# EAGLE design brick_3pin_led_ring (EAGLE 7.4.0)
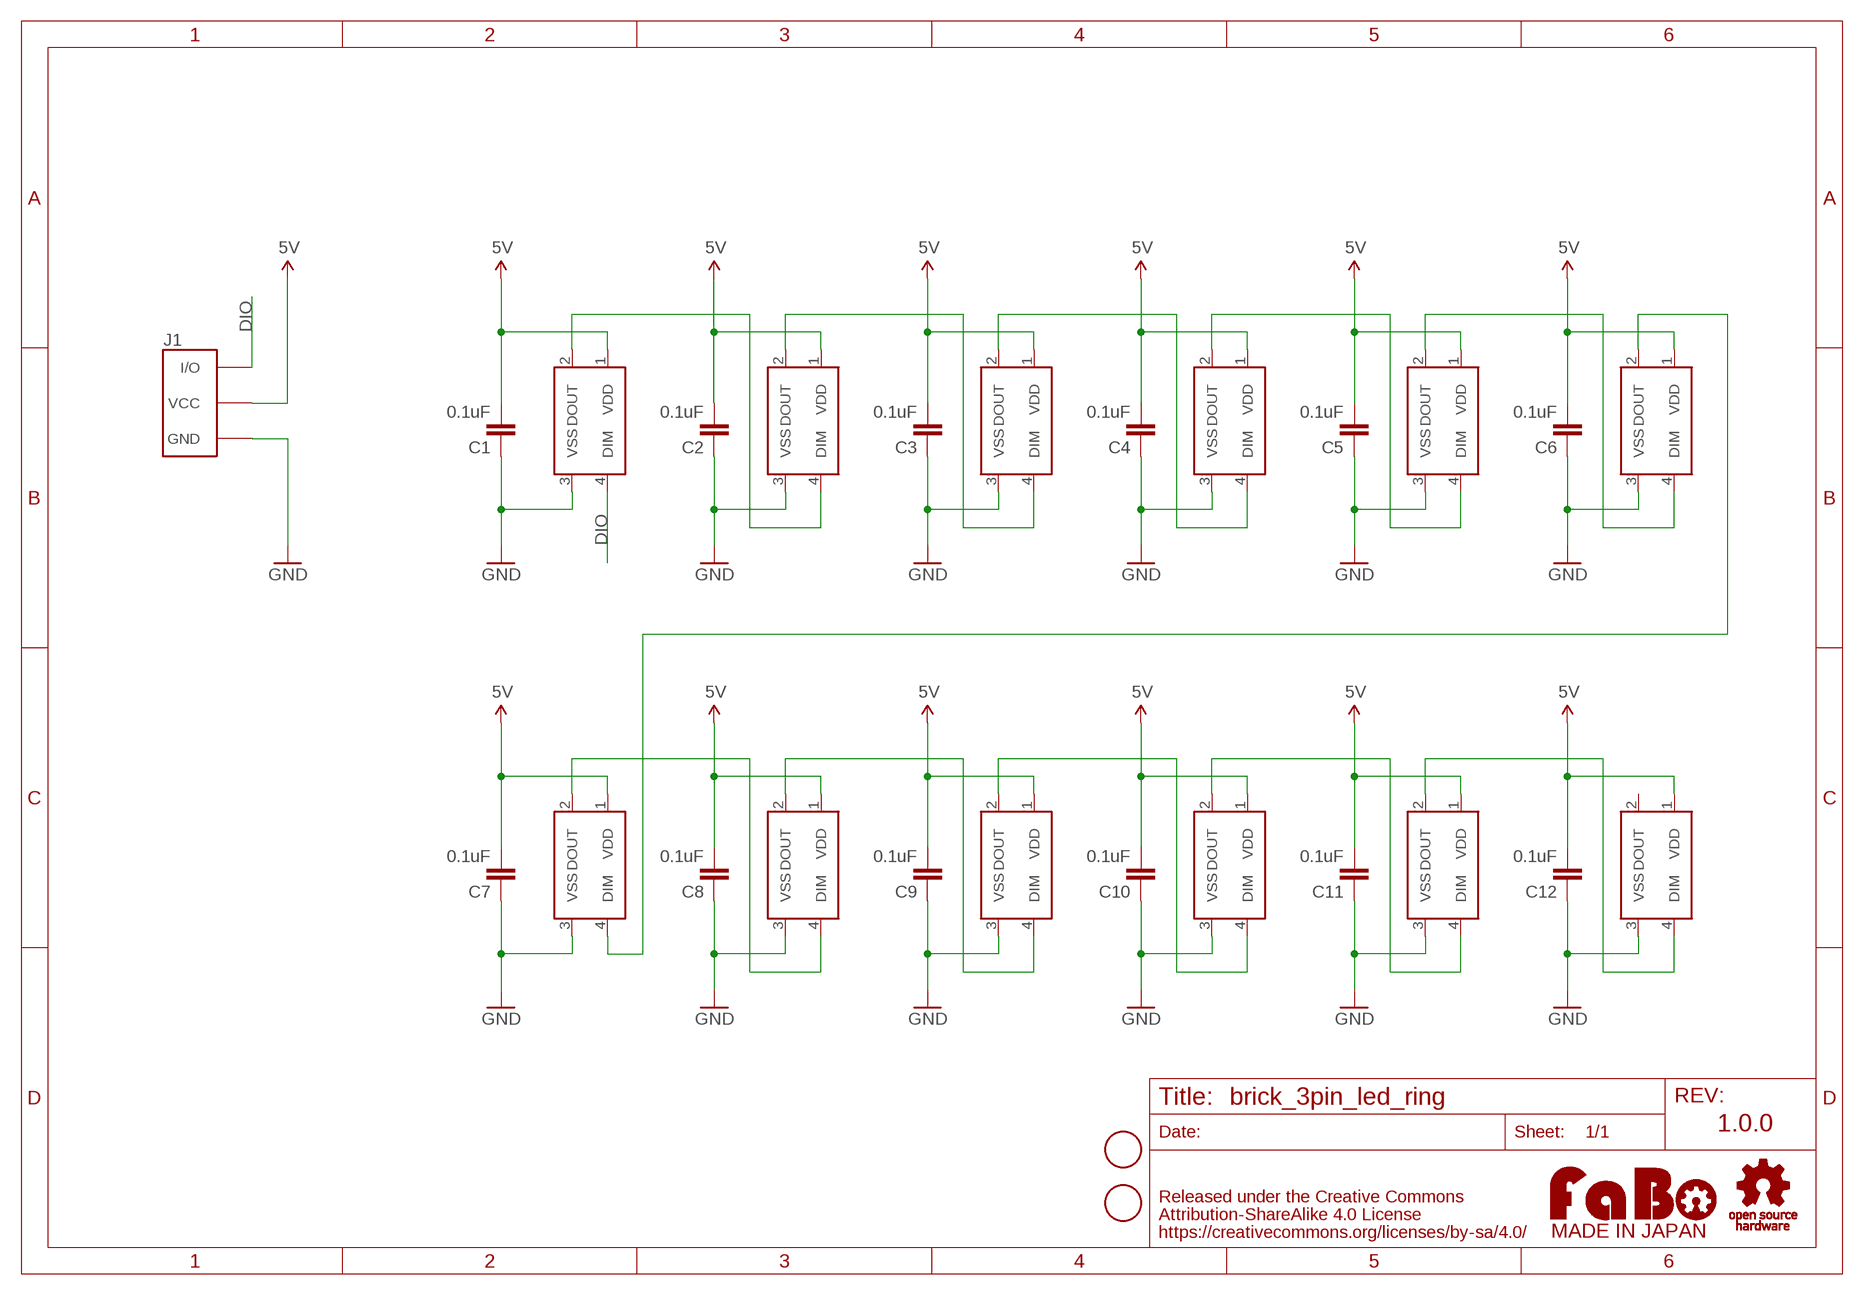
[diagram p0: schematic, sheet 1]

## Parts
C1  0.1uF  CAP-EIA0603  [EIA0603]
C2  0.1uF  CAP-EIA0603  [EIA0603]
C3  0.1uF  CAP-EIA0603  [EIA0603]
C4  0.1uF  CAP-EIA0603  [EIA0603]
C5  0.1uF  CAP-EIA0603  [EIA0603]
C6  0.1uF  CAP-EIA0603  [EIA0603]
C7  0.1uF  CAP-EIA0603  [EIA0603]
C8  0.1uF  CAP-EIA0603  [EIA0603]
C9  0.1uF  CAP-EIA0603  [EIA0603]
C10  0.1uF  CAP-EIA0603  [EIA0603]
C11  0.1uF  CAP-EIA0603  [EIA0603]
C12  0.1uF  CAP-EIA0603  [EIA0603]
J1  BRICK_3PIN_CONNECTOR  [BRICK_3PIN_CONNECTOR]
U$2  WS2818B  [WS2818B]
U$3  WS2818B  [WS2818B]
U$4  WS2818B  [WS2818B]
U$5  WS2818B  [WS2818B]
U$6  WS2818B  [WS2818B]
U$7  WS2818B  [WS2818B]
U$8  WS2818B  [WS2818B]
U$9  WS2818B  [WS2818B]
U$10  WS2818B  [WS2818B]
U$11  WS2818B  [WS2818B]
U$12  WS2818B  [WS2818B]
U$13  WS2818B  [WS2818B]
U$14  LOGO_FABO-M  [LOGO_FABO_M]
U$15  LOGO_OSHW_T-M  [LOGO_OSHW_T_M]
U$16  SCREW-PAD-3MM  [SCREWPAD_3MM]
U$17  SCREW-PAD-3MM  [SCREWPAD_3MM]

## Nets
5V: C1.2 C2.2 C3.2 C4.2 C5.2 C6.2 C7.2 C8.2 C9.2 C10.2 C11.2 C12.2 J1.VCC U$2.1(VDD) U$3.1(VDD) U$4.1(VDD) U$5.1(VDD) U$6.1(VDD) U$7.1(VDD) U$8.1(VDD) U$9.1(VDD) U$10.1(VDD) U$11.1(VDD) U$12.1(VDD) U$13.1(VDD)
DIO: J1.IN/OUT(I/O) U$2.4(DIM)
GND: C1.1 C2.1 C3.1 C4.1 C5.1 C6.1 C7.1 C8.1 C9.1 C10.1 C11.1 C12.1 J1.GND U$2.3(VSS) U$3.3(VSS) U$4.3(VSS) U$5.3(VSS) U$6.3(VSS) U$7.3(VSS) U$8.3(VSS) U$9.3(VSS) U$10.3(VSS) U$11.3(VSS) U$12.3(VSS) U$13.3(VSS)
N$1: U$2.2(DOUT) U$3.4(DIM)
N$3: U$3.2(DOUT) U$4.4(DIM)
N$11: U$4.2(DOUT) U$5.4(DIM)
N$12: U$5.2(DOUT) U$6.4(DIM)
N$13: U$6.2(DOUT) U$7.4(DIM)
N$14: U$7.2(DOUT) U$8.4(DIM)
N$15: U$8.2(DOUT) U$9.4(DIM)
N$16: U$9.2(DOUT) U$10.4(DIM)
N$17: U$10.2(DOUT) U$11.4(DIM)
N$18: U$11.2(DOUT) U$12.4(DIM)
N$19: U$12.2(DOUT) U$13.4(DIM)
Unconnected: U$13.2(DOUT)

## Notes on the sheet
- 1.0.0

## Library data of the parts
C1-C12 = GClue:CAP: Capacitor Standard 0603 ceramic capacitor
J1 = GClue:BRICK_3PIN: FaBo Brick 3pin
U$2-U$13 = GClue-LED:WS2818B
U$14 = FaBo-etc:LOGO_FABO
U$15 = GClue:LOGO_OSHW_T
U$16 U$17 = GClue:SCREW-PAD

## Board
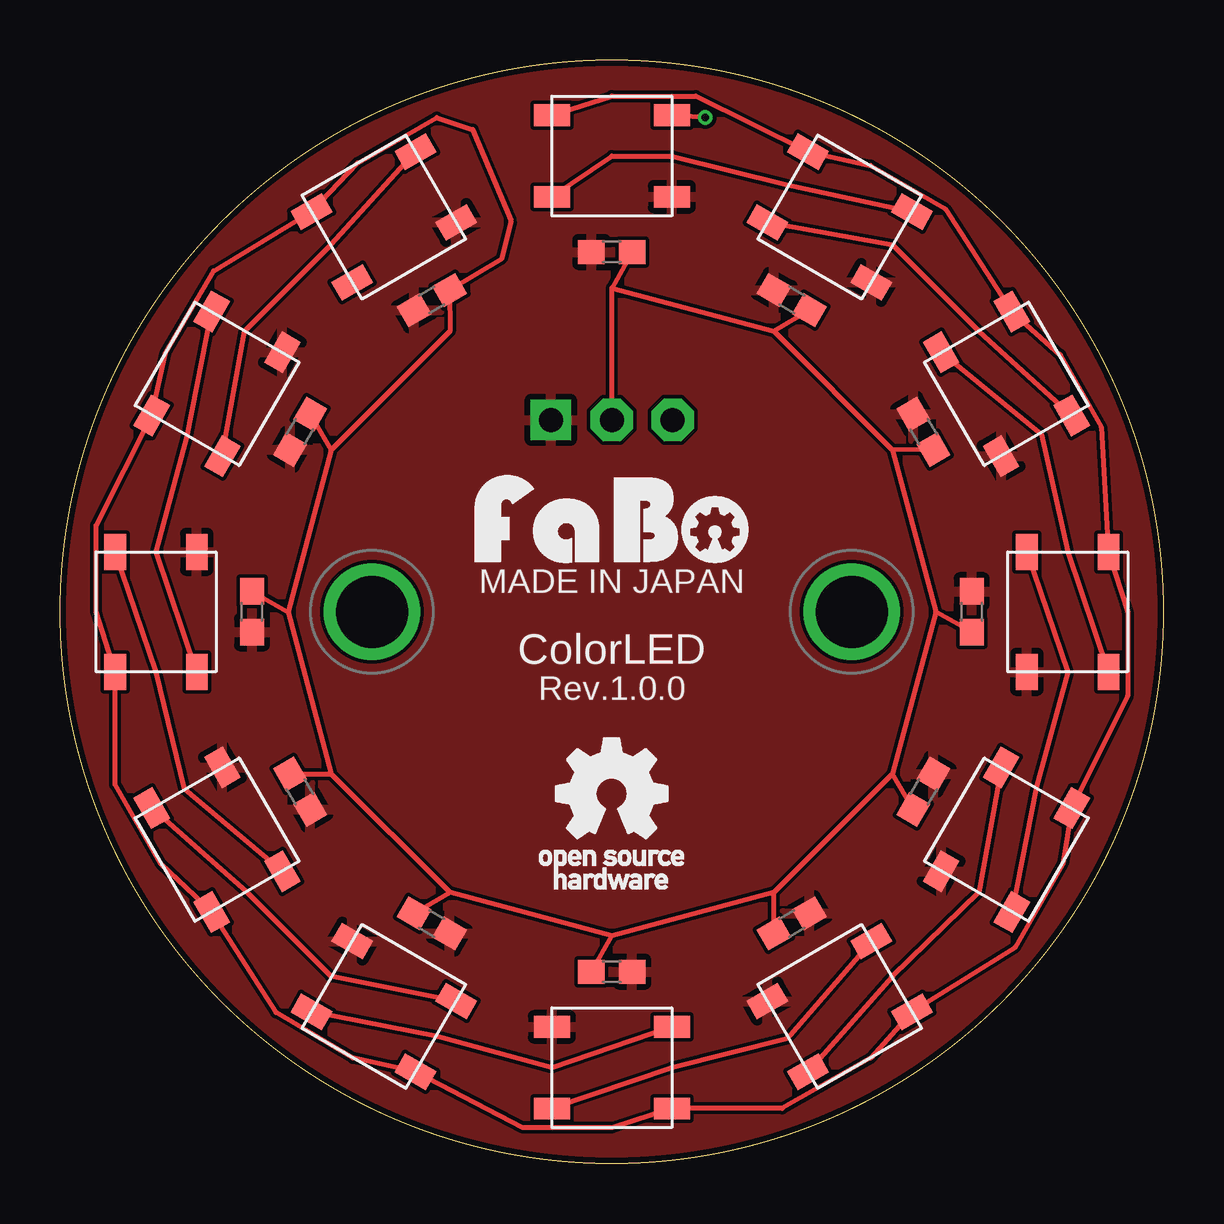
[diagram p1: board, top side]
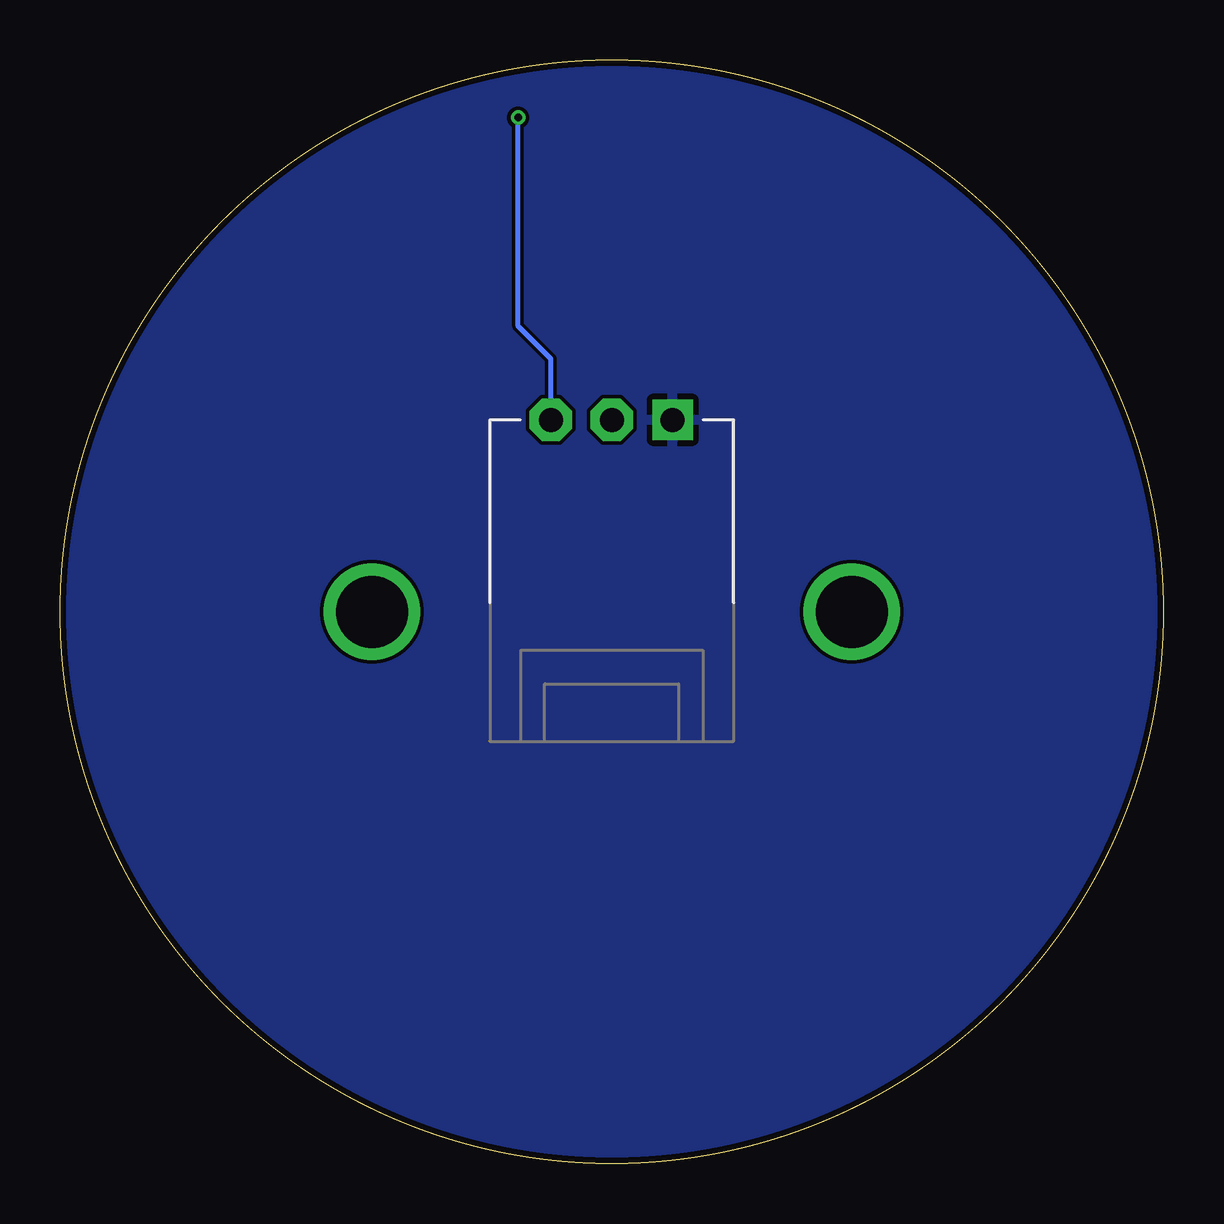
[diagram p2: board, bottom side, seen from below]

Size 46 x 46 mm. Coordinates in mm from the lower left corner, seen from the top.
Outline: circle at 23,23 radius 23
Copper layers (1*16): Top 0.035mm / dielectric 1.5mm / Bottom 0.035mm
Design rules "Elecrow_2-layer_eagle_rule": minimum track width 6mil, minimum drill 12mil, track to track 6mil, track to pad 6mil, pad to pad 6mil, via to via 6mil, smd to smd 0mil, copper to edge 10mil, drill to drill 10mil, minimum pad ring 10mil, minimum via ring 6mil, stop-mask expansion 2mil, vias tented up to drill 100mil, thermal gap 10mil

### Footprints (pad centres in the part's own frame; a part is rotated, then mirrored left to right if it is on the bottom)
EIA0603 = smd 1.1 x 1: 1 -0.85,0; 2 0.85,0
BRICK_3PIN_CONNECTOR = drill 1 pad 1.676 square: GND -2.54,0 | drill 1 pad 1.778 octagon: IN/OUT 2.54,0; VCC 0,0
WS2818B = smd 1.5 x 0.9: 1 -2.5,1.7; 2 -2.5,-1.7; 3 2.5,-1.7; 4 2.5,1.7
SCREWPAD_3MM = drill 3 pad 3.81: 1 0,0

### Placement (x,y rotation side)
C1  23,38 0 top
C2  30.5,35.99 330 top
C3  35.99,30.5 300 top
C4  38,23 270 top
C5  35.99,15.5 240 top
C6  30.5,10.01 210 top
C7  23,8 180 top
C8  15.5,10.01 150 top
C9  10.01,15.5 120 top
C10  8,23 90 top
C11  10.01,30.5 60 top
C12  15.5,35.99 30 top
J1  23,31 180 bottom
U$2  23,42 0 top
U$3  32.5,39.45 330 top
U$4  39.45,32.5 300 top
U$5  42,23 270 top
U$6  39.45,13.5 240 top
U$7  32.5,6.55 210 top
U$8  23,4 180 top
U$9  13.5,6.55 150 top
U$10  6.55,13.5 120 top
U$11  4,23 90 top
U$12  6.55,32.5 60 top
U$13  13.5,39.45 30 top
U$14  23.01,25.04 0 top
U$15  23,15.4 0 top
U$16  13,23 0 top
U$17  33,23 0 top

### Tracks (layer width: path | path; a pad name or v marks a point on that pad's centre or on a via)
5V
  Top 0.203: U$2.1 23,44.5 26.5,44.5 U$3.1 33.8,41.6 36.9,39.8 U$4.1 41.7,33.7 43.4,30.7 U$5.1 44.5,23 44.5,19.5 U$6.1 41.8,12.5 39.8,9 U$7.1 33.8,4.4 30.1,2.3 U$8.1 23,1.5 19.3,1.5 U$9.1 12.2,4.4 9,6.3 U$10.1 4.2,12.5 2.3,15.8 U$11.1 1.5,23 1.5,26.6 U$12.1 4.4,33.8 6.4,37.2 U$13.1 12.4,41.7 15.7,43.6 17.2,43.1 18.8,39.3 18.4,37.7 C12.2 16.25,34.69 11.31,29.75 | C1.2 23,36.5 | C2.2 29.75,34.69 | C3.2 34.69,29.75 | C4.2 36.5,23 | C5.2 34.69,16.25 | C6.2 29.75,11.31 | C7.2 23,9.5 | C8.2 16.25,11.31 | C9.2 11.31,16.25 | J1.VCC 23,36.5 | 23,36.5 29.75,34.69 | 29.75,34.69 34.69,29.75 | 34.69,29.75 36.5,23 | 36.5,23 34.69,16.25 | 34.69,16.25 29.75,11.31 | 29.75,11.31 23,9.5 | 23,9.5 16.25,11.31 | 11.31,16.25 16.25,11.31 | C10.2 9.5,23 | 9.5,23 11.31,16.25 | C11.2 11.31,29.75 | 11.31,29.75 9.5,23
DIO  (via drill 0.3)
  Top 0.203: v26.9,43.6 U$2.4
  Bottom 0.203: J1.IN/OUT 25.54,33.54 26.9,34.9 v26.9,43.6
GND
  pour Top: -1,47 47,47 47,-1 -1,-1
  pour Bottom: -1,47 47,47 47,-1 -1,-1
N$1
  Top 0.203: U$2.2 23,42 25.5,42 30.3,40.8 U$3.4
N$3
  Top 0.203: U$3.2 34.7,38.3 38.3,34.7 U$4.4
N$11
  Top 0.203: U$4.2 40.9,30.4 42,25.5 U$5.4
N$12
  Top 0.203: U$5.2 42,20.5 40.7,15.7 U$6.4
N$13
  Top 0.203: U$6.2 38.3,11.3 34.7,7.8 U$7.4
N$14
  Top 0.203: U$7.2 30.3,5.2 25.5,4 U$8.4
N$15
  Top 0.203: U$8.2 20.5,4 15.7,5.3 U$9.4
N$16
  Top 0.203: U$9.2 11.3,7.8 7.8,11.3 U$10.4
N$17
  Top 0.203: U$10.2 5.2,15.6 4,20.5 U$11.4
N$18
  Top 0.203: U$11.2 4,25.5 5.3,30.3 U$12.4
N$19
  Top 0.203: U$12.2 7.7,34.7 11.3,38.3 U$13.4

### Text on the board
tPlace: MADE IN JAPAN | ColorLED | Rev.1.0.0